# Altium schematic sheet Simu_Altium.SchDoc
size A4
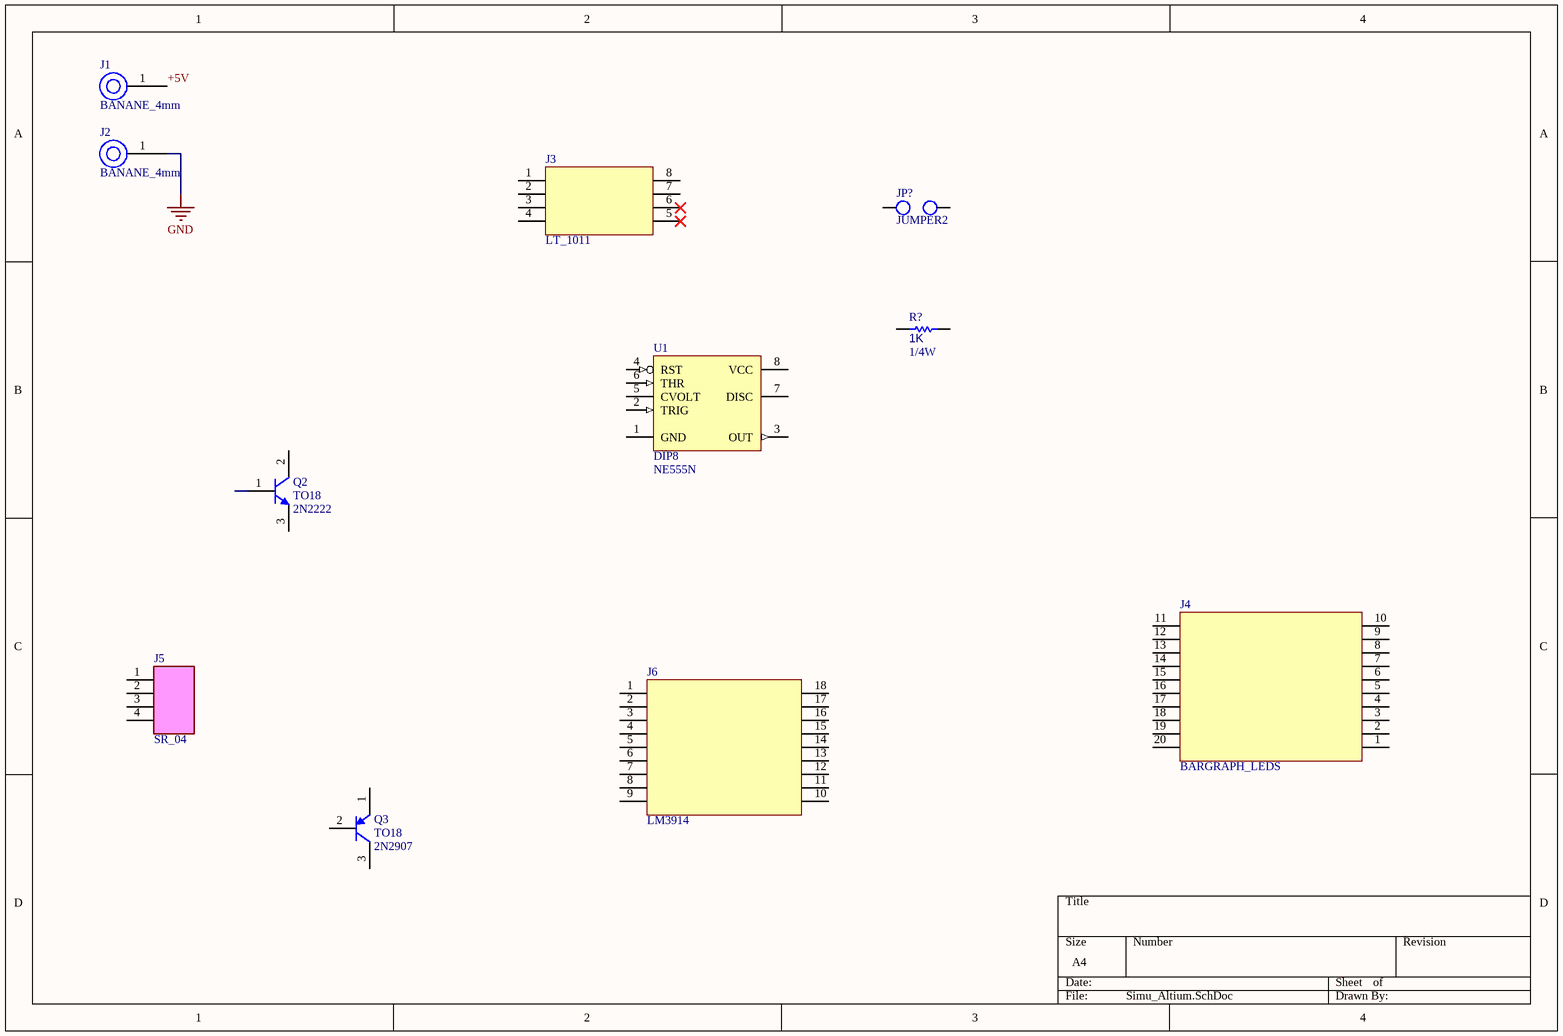
[diagram p0: Simu_Altium.SchDoc]

## Parts
J1  Type: BANANE_4mm  [DOUILLE_BANANE_4mm]  (hidden comment: DOUILLE BANANE 4mm)
J2  Type: BANANE_4mm  [DOUILLE_BANANE_4mm]  (hidden comment: DOUILLE BANANE 4mm)
J3  Type: LT_1011  [DIP8_MONTAGE CMS_PAS=2.54_LARG=7.62_LONG=10.9]  (hidden comment: COMPOSANT_8_BROCHES)
J4  Type: BARGRAPH_LEDS  [DIP20_PAS=2.54_LARG=7.62_LONG=25.6]  (hidden comment: COMPOSANT_20_BROCHES)
J5  Type: SR_04  [BARRETTE_4_F_D]  (hidden comment: BARRETTE_4 CONTACTS_1 RANGEE_FEMELLE_DROITE)
J6  Type: LM3914  [DIP18_PAS=2.54_LARG=7.62_LONG=23]  (hidden comment: COMPOSANT_18_BROCHES)
JP?  JUMPER2  [BARRETTE_2_M_D]
Q2  Package: TO18  Type: 2N2222  [TRANSISTOR_BIPOL_TO18_BCE]  (hidden comment: TRANSISTOR_NPN_TO18_BCE : 2N2222)
Q3  Package: TO18  Type: 2N2907  [TRANSISTOR_BIPOL_TO18_EBC]  (hidden comment: TRANSISTOR_PNP_TO18_EBC : 2N2907)
R?  value 1K  Type: 1/4W  [RESISTANCE_1/2W]  (hidden comment: RESISTANCE_AXIALE_1/4W)
U1  Package: DIP8  Type: NE555N  [DIP8_PAS=2.54_LARG=7.62_LONG=10.9]  (hidden comment: NE555N_DIP8)

## Nets
GND: J2.1
+5V: J1.1

Not connected (* = marked no-connect by the designer): J3 1 2 3 4 5* 6* 7 8; J4 1 2 3 4 5 6 7 8 9 10 11 12 13 14 15 16 17 18 19 20; J5 1 2 3 4; J6 1 2 3 4 5 6 7 8 9 10 11 12 13 14 15 16 17 18; JP? 1 2; Q2 1(B) 2(C) 3(E); Q3 1(E) 2(B) 3(C); R? 1 2; U1 1(GND) 2(TRIG) 3(OUT) 4(RST) 5(CVOLT) 6(THR) 7(DISC) 8(VCC)

## Library data of the parts
J1 J2 = DOUILLE_BANANE_4mm: DOUILLE BANANE 4 mm
J3 = SYMBOLE_COMPOSANT_8_BROCHES
J4 = SYMBOLE_COMPOSANT_20_BROCHES
J5 = BARRETTE_4 CONTACTS_1 RANGEE_FEMELLE_DROITE: BARRETTE 4 CONTACTS 1 RANGEE FEMELLE DROITE
J6 = SYMBOLE_COMPOSANT_18_BROCHES
JP? = JUMPER2: BARRETTE 2 CONTACTS 1 RANGEE MALE DROITE; Type: JUMPER2
Q2 = TRANSISTOR_NPN_TO18_BCE : 2N2222: TRANSISTOR BIPOLAIRE NPN TO18_BCE : 2N2222
Q3 = TRANSISTOR_PNP_TO18_EBC : 2N2907: TRANSISTOR PNP TO18_EBC : 2N2907
R? = RESISTANCE_AXIALE_1/4W: RESISTANCE TRAVERSANTE AXIALE 1/4W
U1 = NE555N_DIP8: TIMER DE PRECISION - FONCTIONNEMENTS ASTABLE/MONOSTABLE - DIP8